# Altium schematic sheet USB_Input.SchDoc
size A4; SheetNumber: 2; SheetTotal: 4
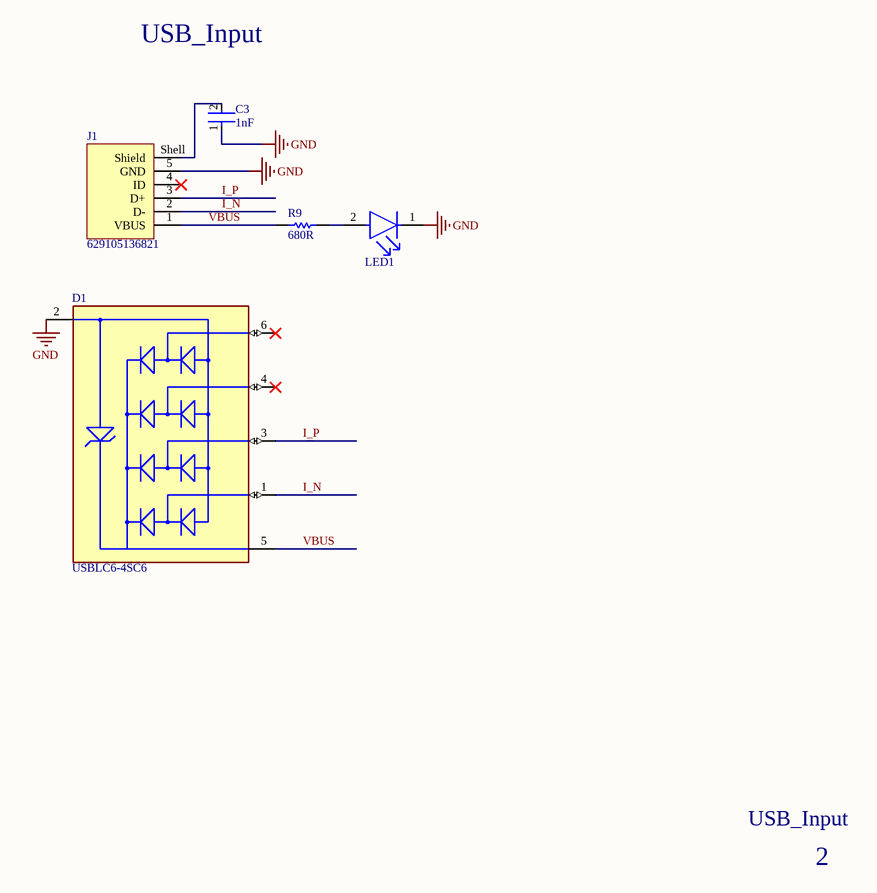
[diagram p0: USB_Input.SchDoc]

## Parts
C3  1nF  [FP-CC0603-DA-MFG]
D1  USBLC6-4SC6  [FP-SOT23-6L-MFG]
J1  629105136821  [629105136821]
LED1  LS R976-NR-1  [FP-LS_R976-MFG]  (value not drawn)
R9  680R  [RESC1608X55X30ML20T20]

## Nets
GND: C3.1 D1.2(GND) J1.5(GND) LED1.1(C)
I_N: D1.1(I/O1) J1.2(D-)
I_P: D1.3(I/O2) J1.3(D+)
VBUS: D1.5(VBUS) J1.1(VBUS) R9.2
NetC3_2: C3.2 J1.Shell(Shield)
NetLED1_2: LED1.2(A) R9.1

Not connected (* = marked no-connect by the designer): D1 4(I/O3)* 6(I/O4)*; J1 4(ID)*

## Notes on the sheet
- USB_Input
- 2

## Library data of the parts
C3 = CMP-2100-03599-2: CAP CER 1000PF 50V X7R 0603; Manufacturer Part Number: CC0603KRX7R9BB102; Manufacturer: YAGEO; Material: Ceramic; Capacitance: 1.0 nF; Tolerance: 0.1; Value: 1.0 nF; Temperature Coefficient: 15%; Device Class L3: Ceramic Capacitors; Automotive: No; Digikey Description: CAP CER 1000PF 50V X7R 0603; Lead Free: Yes; Temperature Range High: +125°C; ComponentLink2URL: http://www.yageo.com/documents/recent/UPY-GPHC_X7R_6.3V-to-50V_18.pdf; Category: Cap; Footprint Url: http://www.yageo.com/exep/pages/download/literatures/UPY-C_GEN_24.pdf; RoHS: TRUE; Octopart: https://octopart.com/cc0603krx7r9bb102-yageo-192933; ComponentLink2Description: Datasheet; Device Class L2: Capacitors; Mouser Description: Multilayer Ceramic Capacitors MLCC - SMD/SMT 1.0nF 50V X7R 10%; Temperature Range Low: -55°C; Temperature Characteristic: X7R; Device Class L1: Passive Components; Temperature: -55°C to +125°C; Package: CC0603-DA; Voltage: 50 V; Voltage Rating: 50 V; Height: 0.9mm
D1 = CMP-2000-07370-2: TVS DIODE 5.25V 17V SOT23-6; Manufacturer: STMicroelectronics; Peak Pulse Power: 130W; Breakdown Voltage: 6V; Value: 3pF; Direction: Unidirectional; Interface: USB,Ethernet,Other; Number Of Channels: 4; Standoff Height: 0mm; Max Junction Temp: +125°C; Digikey Description: TVS DIODE 5.25V 17V SOT23-6; Automotive: No; Package: SOT23-6L; Mouser Description: USBLC6 Series 4 Line 6 V Uni / Bi-Directional ESD Protection - SOT-23-6; Octopart: https://octopart.com/usblc6-4sc6-stmicroelectronics-347147; RoHS: TRUE; ComponentLink2URL: https://upverter.com/datasheet/23dc4ffb028d868909e80577610284b194f13213.pdf; ComponentLink2Description: Datasheet; Device Class L1: Circuit Protection; Lead Free: Yes; Temperature Range High: +125°C; Device Class L2: ESD and Circuit Protection ICs; Device Class L3: unset; Capacitance: 3pF; Height: 1.45mm; Temperature Range Low: -40°C; Manufacturer Part Number: USBLC6-4SC6; Temperature: -40°C to +125°C; Category: Diode; Clamping Voltage: 17V
J1 = CMP-1502-03253-2: NexarPartId: 19991173; Insulation Resistance: 1GΩ; Contact Resistance: 30mΩ; Number of Contacts: 5; Number of Ports: 1; Gender: Receptacle; Current Rating: 1A; Connector Type: USB; Voltage Rating: 30V; USB Standard: USB 2.0; Plating: Nickel; Max Operating Temperature: 105°C; Orientation: Horizontal; Height: 2.9mm; Termination: Solder; Min Operating Temperature: -40°C; Number of Pins: 5; Flammability Rating: UL94 V-0; Lead Free: Lead Free; Packaging: Tape and Reel; Contact Plating: Gold; RoHS: Compliant; Mount: Horizontal, Surface Mount; Color: Black; REACH SVHC: Unknown; Operating Supply Voltage: 30V; Contact Material: Copper; Number of Positions: 5; Length: 5.9mm
LED1 = CMP-62016-000037-1: LED RED DIFFUSED 0805 SMD; Lens Size: 1.25mm; Number of LEDs: 1; Luminous Intensity: 180mcd; Dominant Wavelength: 633nm; Lens Style: Flat; Reverse Voltage: 12V; Lens Color: White; Forward Voltage: 2.5V; Forward Current: 25mA; Power Dissipation: 65W; Luminous Flux: 0.47lm; Test Current: 20mA; Viewing Angle: 160°; Length: 2mm; Number of Pins: 2; Lens Transparency: Diffused; Min Operating Temperature: -30°C; Case Code (Metric): 2012; Depth: 1.35mm; Color: Red; Illumination Color: Red; Max Operating Temperature: 85°C; Mount: Surface Mount; Case/Package: 0805; Height: 0.9mm; Package Quantity: 16000; Number of Elements: 1; Radiation Hardening: No; Case Code (Imperial): 0805; Packaging: Tape and Reel; Width: 1.25mm
R9 = CMP-2000-00114-1: Manufacturer: Panasonic; Part Number: ERA-3AEB681V